# Altium project Industrial-Controller.PrjPcb (part 2 of 3)

## Sheet Industrial-Controller_Input.SchDoc: Isolated inputs
size 279 x 215 mm; Date: not used; ApprovedBy: not used; CheckedBy: not used; Author: not used; CompanyName: MRobot, LCC; DrawnBy: not used; Engineer: Podlesnyi Vasilii; Organization: not used; Address1: nab. reki Karpovki, d. 5/3E; Address2: Saint-Petersburg, 197022; Address3: Ph: +7 (911) 701-51-99; Address4: not used; DocumentNumber: 0000-0000; Revision: 0.1.0; SheetNumber: 5; SheetTotal: 21; ProjectTitle: Industrial Controller; Time: not used; ImagePath: not used; Application_BuildNumber: not used
Used 3 times, as channels Isolated inputs1, Isolated inputs2, Isolated inputs3. Parts and nets are listed once, with the designators drawn on the sheet.
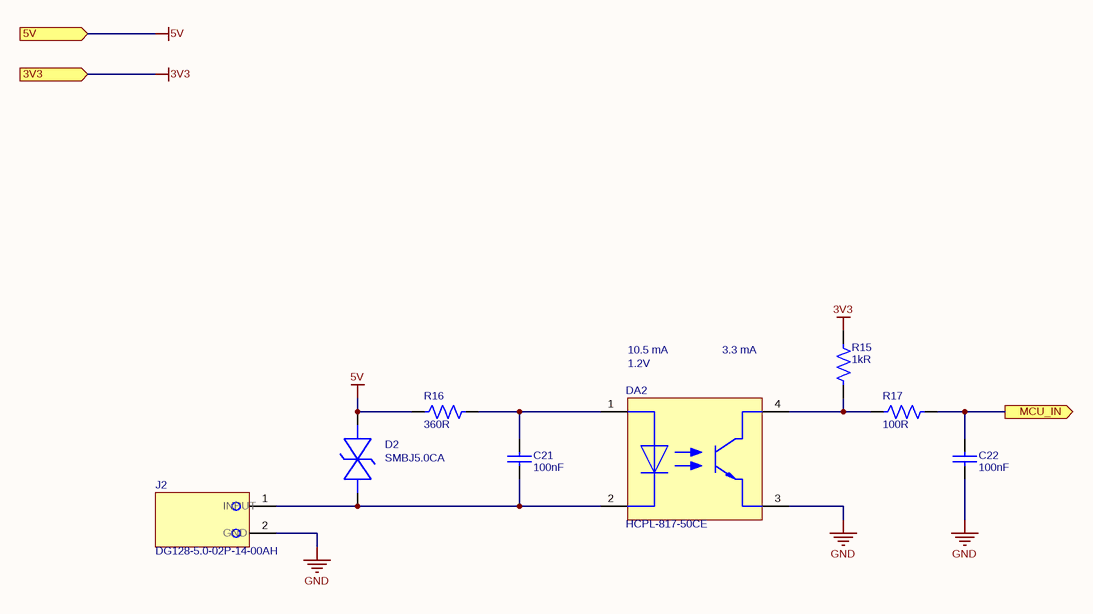
[diagram p5: Industrial-Controller_Input.SchDoc]

### Parts
C21  100nF  [CAP_0603]
C22  100nF  [CAP_0603]
D2  SMBJ5.0CA  [SMB-BIDIR]
DA2  HCPL-817-50CE  [HCPL-817-50CE]
J2  DG128-5.0-02P-14-00AH  [DG128-5.0-02P-14]
R15  1kR  [RES_0603]
R16  360R  [RES_0603]
R17  100R  [RES_0603]

### Ports
3V3 (in), 5V (in), MCU_IN (out)

### Nets
3V3: R15.1 ; port 3V3
5V: D2.1 R16.1 ; port 5V
GND: C22.2 DA2.3(EMITTER) J2.2
MCU_IN: C22.1 R17.1 ; port MCU_IN
NetC21_1: C21.1 DA2.1(ANODE) R16.2
NetC21_2: C21.2 D2.2 DA2.2(CATHODE) J2.1
NetDA2_4: DA2.4(COLLECTOR) R15.2 R17.2

### Channels
Isolated inputs1: designators end in A; ports 3V3=3V3 5V=5V MCU_IN=MCU_IN1
Isolated inputs2: designators end in B; ports 3V3=3V3 5V=5V MCU_IN=MCU_IN2
Isolated inputs3: designators end in C; ports 3V3=3V3 5V=5V MCU_IN=MCU_IN3

### Notes on the sheet
- (near DA2) 1.2V
- 10.5 mA
- 3.3 mA
- Title:
- Date:
- Size A
- Project:
- Number:
- Time:
- Sheet
- Revision
- of
- Engineer:
- www.mrobots.ru <http://mrobots.ru/>
- File:

### Library data of the parts
C21 C22 = CL10B104KB8NNNL: CAP CER 0.1UF 50V X7R 0603; Manufacturer 1: Samsung; Tolerance: 10%; Supplier 1: Digi-Key; Manufacturer Part Number 1: CL10B104KB8NNNL; RoHS: Yes; Category: Ceramic Capacitors; Stock 1: 2348404; Pricing 1: 15000=0,00532, 30000=0,00506 (USD); Mount: Surface Mount; Case/Package: 0603; Min Operating Temperature: -55°C; Max Operating Temperature: 125°C; Capacitance: 100nF; Packaging: Tape and Reel; Package Quantity: 15000; Voltage Rating: 50V; Dielectric: X7R; Voltage Rating (DC): 50V; Series: CL; Construction: Flat; Length: 1.6mm; Width: 0.031inch; Height: 0.8mm; Thickness: 0.035inch; Depth: 0.8mm; Radiation Hardening: No; RoHS Compliant: Yes; ComponentLink1URL: https://datasheet.ciiva.com/26838/getdatasheetpartid-357523-26838415.pdf?src-supplier=Verical; ComponentLink1Description: https://datasheet.ciiva.com/26838/getdatasheetpartid-357523-26838415.pdf?src-supplier=Verical; ComponentLink2URL: https://datasheet.ciiva.com/25741/cl10b104kb8nnnl-25741341.pdf?src-supplier=Digi-Key; ComponentLink2Description: https://datasheet.ciiva.com/25741/cl10b104kb8nnnl-25741341.pdf?src-supplier=Digi-Key; Supplier Part Number 1: 1276-CL10B104KB8NNNLTR-ND
D2 = SMBJ5.0CA: TVS DIODE 5VWM 9.2VC SMB; Manufacturer 1: Bourns; Direction: Bidirectional; Max Surge Current: 100A; Reverse Breakdown Voltage: 6.4V; Reverse Standoff Voltage: 5V; Clamping Voltage: 9.2V; Peak Pulse Power: 600W; Breakdown Voltage: 7.25V; Max Reverse Leakage Current: 1.6mA; Test Current: 10mA; Number of Elements: 1; Peak Pulse Current: 65.2A; Element Configuration: Single; Diode Type: ZENER; Operating Supply Voltage: 3.5V; Power Line Protection: No; Supplier 1: Arrow Electronics; RoHS: Yes; Category: TVS Diodes; Stock 1: 3000; Pricing 1: 3000=0,10850, 6000=0,10460, 15000=0,10360, 30000=0,10260 (USD); Mount: Surface Mount; Case/Package: DO-214AA; Number of Pins: 2; Min Operating Temperature: -55°C; Max Operating Temperature: 150°C; Packaging: Tape and Reel; Package Quantity: 1; Min Breakdown Voltage: 6.4V; Polarity: Bidirectional; Termination: SMD/SMT; Max Breakdown Voltage: 7.25V; Leakage Current: 1.6mA; Series: SMBJ; Number of Bidirectional Channels: 1; Number of Channels: 1; Max Power Dissipation: 600W; Resistor Type: Zener; Radiation Hardening: No; RoHS Compliant: Yes; REACH SVHC: No SVHC; ComponentLink1URL: https://datasheet.ciiva.com/334/smbj-334706.pdf?src-supplier=Digi-Key; ComponentLink1Description: https://datasheet.ciiva.com/334/smbj-334706.pdf?src-supplier=Digi-Key; ComponentLink2URL: https://datasheet.ciiva.com/3022/smbj-3022578.pdf?src-supplier=Avnet; ComponentLink2Description: https://datasheet.ciiva.com/3022/smbj-3022578.pdf?src-supplier=Avnet; ComponentLink3URL: https://datasheet.ciiva.com/334/smbj-334707.pdf?src-supplier=Digi-Key; ComponentLink3Description: https://datasheet.ciiva.com/334/smbj-334707.pdf?src-supplier=Digi-Key; ComponentLink4URL: https://datasheet.ciiva.com/334/smbj-334708.pdf?src-supplier=Digi-Key; ComponentLink4Description: https://datasheet.ciiva.com/334/smbj-334708.pdf?src-supplier=Digi-Key; ComponentLink5URL: https://datasheet.ciiva.com/28410/1677318-28410120.pdf?src-supplier=Element14; ComponentLink5Description: https://datasheet.ciiva.com/28410/1677318-28410120.pdf?src-supplier=Element14; ComponentLink6URL: https://datasheet.ciiva.com/8031/1677318-8031161.pdf?src-supplier=Element14; ComponentLink6Description: https://datasheet.ciiva.com/8031/1677318-8031161.pdf?src-supplier=Element14; ComponentLink7URL: https://datasheet.ciiva.com/30104/smbj-30104446.pdf?src-supplier=Onlinecomponents.com; ComponentLink7Description: https://datasheet.ciiva.com/30104/smbj-30104446.pdf?src-supplier=Onlinecomponents.com; Supplier Part Number 1: SMBJ5.0CA; Manufacturer Part Number 1: SMBJ5.0CA
DA2 = HCPL-817-50CE: OPTOISOLATOR 5KV TRANSISTOR 4SMD; Manufacturer 1: Broadcom Avago; Reverse Breakdown Voltage: 6V; Forward Voltage: 1.2V; Forward Current: 50mA; Rise Time: 18000ns; Max Power Dissipation: 200mW; Number of Channels: 1; Collector Emitter Voltage (VCEO): 35V; Collector Emitter Saturation Voltage: 200mV; Max Output Voltage: 70V; Current Transfer Ratio: 400%; Input Current: 20mA; Input Type: DC; Approvals: UL; Supplier 1: Mouser; RoHS: Yes; Category: Optocouplers; Stock 1: 53747; Pricing 1: 1=0,55000, 10=0,35900, 50=0,35900, 100=0,23700, 1000=0,18200, 10000=0,15000 (USD); Mount: Surface Mount; Case/Package: SMD/SMT; Number of Pins: 4; Min Operating Temperature: -30°C; Max Operating Temperature: 100°C; Package Quantity: 1000; Packaging: Tape and Reel; Max Collector Current: 50mA; Output Current per Channel: 50mA; Number of Elements: 1; Power Dissipation: 200mW; Fall Time: 18000ns; Max Input Current: 50mA; Collector Emitter Breakdown Voltage: 70V; Isolation Voltage: 5kV; Number of Circuits: 1; Output Voltage: 70V; Series: -; Collector-emitter Voltage-Max: 200mV; Lead Free: Lead Free; RoHS Compliant: Yes; ComponentLink1URL: https://datasheet.ciiva.com/32424/hcpl-817-00ae-eng-tds-32424469.pdf?src-supplier=Distrelec; ComponentLink1Description: https://datasheet.ciiva.com/32424/hcpl-817-00ae-eng-tds-32424469.pdf?src-supplier=Distrelec; ComponentLink2URL: https://datasheet.ciiva.com/4702/v02-0265en-106799-4702156.pdf?src-supplier=Mouser; ComponentLink2Description: https://datasheet.ciiva.com/4702/v02-0265en-106799-4702156.pdf?src-supplier=Mouser; Supplier Part Number 1: 630-HCPL-817-50CE; Manufacturer Part Number 1: HCPL-817-50CE
J2 = DG128-5.0-02P-14: TERM BLK 2P TOP ENTRY 5MM SMD; Manufacturer 1: Degson; Number of Contacts: 2; Stripping Length: 7mm; Contact_1: INPUT; Contact_2: GND; Category: Uncategorized; Color: Green; Contact Material: Brass,Tin; Height: 17.6mm; Length: 10.2mm; Mount: Screw; Pitch: 5mm; Weight: 2.4g; Width: 10mm; Manufacturer Part Number 1: DG128-5.0-02P-14-00AH
R15 = RC0603FR-071KL: RES 1K OHM 1% 1/10W 0603; Manufacturer 1: Yageo; Temperature Coefficient: 100ppm/°C; Power Rating: 100mW; Voltage Rating: 50V; Supplier 1: Arrow Electronics; Manufacturer Part Number 1: RC0603FR-071KL; RoHS: Yes; Category: Chip SMD Resistors; Stock 1: 480000; Pricing 1: 5000=0,00240, 10000=0,00230, 25000=0,00220, 125000=0,00190 (USD); Case/Package: 0603; Contact Plating: Tin,Matte; Case Code (Imperial): 0603; Case Code (Metric): 1608; Size Code: 0603; Min Operating Temperature: -55°C; Max Operating Temperature: 155°C; Tolerance: 1%; Resistance: 1kR; Packaging: Tape and Reel; Resistor Type: Thick Film; Termination: SMD/SMT; Features: Moisture Resistant; Series: RC; Max Power Dissipation: 100mW; Number of Terminations: 2; Technology: THICK FILM; Resistance Tolerance: 1%; Construction: Rectangular; Length: 1.6mm; Height: 0.45mm; Depth: 0.8mm; Radiation Hardening: No; REACH SVHC: No SVHC; Lead Free: Lead Free; Military Standard: Not; RoHS Compliant: Yes; Supplier Part Number 1: RC0603FR-071KL
R16 = RC0603FR-07360RL: RES 360 OHM 1% 1/10W 0603; Manufacturer 1: Yageo; Power Rating: 100mW; Voltage Rating: 50V; Temperature Coefficient: 100ppm/°C; Supplier 1: Arrow Electronics; RoHS: Yes; Category: Chip SMD Resistors; Stock 1: 7884; Pricing 1: 1=0,05320, 10=0,01120, 100=0,00760, 250=0,00660, 1000=0,00380, 3000=0,00370, 6000=0,00230 (USD); Case/Package: 0603; Case Code (Metric): 1608; Case Code (Imperial): 0603; Size Code: 0603; Min Operating Temperature: -55°C; Max Operating Temperature: 155°C; Packaging: Tape and Reel; Resistance: 360R; Tolerance: 1%; Package Quantity: 1; Resistor Type: Thick Film; Number of Terminations: 2; Termination: SMD/SMT; Max Power Dissipation: 100mW; Voltage Rating (DC): 50V; Features: Moisture Resistant; Series: RC; Construction: Rectangular; Length: 1.6mm; Width: 0.031inch; Height: 0.022inch; Depth: 0.8mm; Military Standard: Not; Lead Free: Lead Free; RoHS Compliant: Yes; ComponentLink1URL: https://datasheet.ciiva.com/2454/pyu-r-int-thick-7-2454271.pdf?src-supplier=Digi-Key; ComponentLink1Description: https://datasheet.ciiva.com/2454/pyu-r-int-thick-7-2454271.pdf?src-supplier=Digi-Key; ComponentLink2URL: https://datasheet.ciiva.com/2454/pyu-r-int-thick-7-2454272.pdf?src-supplier=Digi-Key; ComponentLink2Description: https://datasheet.ciiva.com/2454/pyu-r-int-thick-7-2454272.pdf?src-supplier=Digi-Key; ComponentLink3URL: https://datasheet.ciiva.com/2454/pyu-r-int-thick-7-2454270.pdf?src-supplier=Digi-Key; ComponentLink3Description: https://datasheet.ciiva.com/2454/pyu-r-int-thick-7-2454270.pdf?src-supplier=Digi-Key; ComponentLink4URL: https://datasheet.ciiva.com/12558/rc0603-272842-12558645.pdf?src-supplier=Mouser; ComponentLink4Description: https://datasheet.ciiva.com/12558/rc0603-272842-12558645.pdf?src-supplier=Mouser; Supplier Part Number 1: RC0603FR-07360RL; Manufacturer Part Number 1: RC0603FR-07360RL
R17 = RC0603FR-07100RL: RES 100 OHM 1% 1/10W 0603; Manufacturer 1: Yageo; Voltage Rating (DC): 50V; Temperature Coefficient: 100ppm/°C; Power Rating: 100mW; Supplier 1: Arrow Electronics; RoHS: Yes; Category: Chip SMD Resistors; Stock 1: 17580000; Pricing 1: 5000=0,00180 (USD); Case/Package: 0603; Number of Pins: 2; Case Code (Imperial): 0603; Case Code (Metric): 1608; Size Code: 0603; Min Operating Temperature: -55°C; Max Operating Temperature: 155°C; Resistance: 100R; Tolerance: 1%; Packaging: Tape and Reel; Resistor Type: Thick Film; Voltage Rating: 50V; Termination: SMD/SMT; Features: Moisture Resistant; Series: RC; Max Power Dissipation: 100mW; Number of Terminations: 2; Construction: Rectangular; Resistance Tolerance: 1%; Technology: THICK FILM; Length: 1.6mm; Width: 0.8mm; Height: 0.45mm; Depth: 0.8mm; REACH SVHC: Unknown; Lead Free: Lead Free; Military Standard: Not; RoHS Compliant: Yes; Supplier Part Number 1: RC0603FR-07100RL; Manufacturer Part Number 1: RC0603FR-07100RL

## Sheet Industrial-Controller_Relay.SchDoc: Relays
size 279 x 215 mm; Date: not used; ApprovedBy: not used; CheckedBy: not used; Author: not used; CompanyName: MRobot, LCC; DrawnBy: not used; Engineer: Podlesnyi Vasilii; Organization: not used; Address1: nab. reki Karpovki, d. 5/3E; Address2: Saint-Petersburg, 197022; Address3: Ph: +7 (911) 701-51-99; Address4: not used; DocumentNumber: 0000-0000; Revision: 0.1.0; SheetNumber: 6; SheetTotal: 21; ProjectTitle: Industrial Controller; Time: not used; ImagePath: not used; Application_BuildNumber: not used
Used 4 times, as channels Relays1, Relays2, Relays3, Relays4. Parts and nets are listed once, with the designators drawn on the sheet.
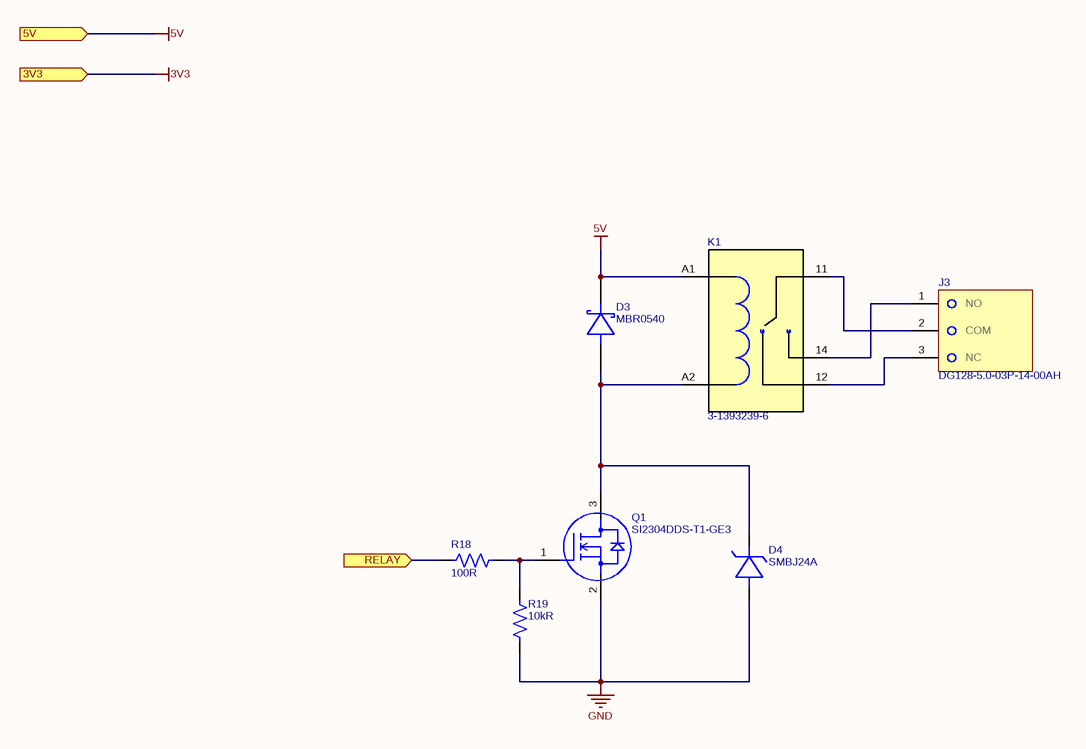
[diagram p6: Industrial-Controller_Relay.SchDoc]

### Parts
D3  MBR0540  [SOD-123]
D4  SMBJ24A  [SMB]
J3  DG128-5.0-03P-14-00AH  [DG128-5.0-03P-14]
K1  3-1393239-6  [3-1393239-6]
Q1  SI2304DDS-T1-GE3  [SOT-23-3]
R18  100R  [RES_0603]
R19  10kR  [RES_0603]

### Ports
3V3 (in), 5V (in), RELAY (in)

### Nets
3V3: port 3V3
5V: D3.1(C) K1.A1 ; port 5V
GND: D4.2(A) Q1.2(S) R19.2
RELAY: R18.1 ; port RELAY
NetD3_2: D3.2(A) D4.1(C) K1.A2 Q1.3(D)
NetJ3_1: J3.1 K1.14(NO)
NetJ3_2: J3.2 K1.11(COM)
NetJ3_3: J3.3 K1.12(NC)
NetQ1_1: Q1.1(G) R18.2 R19.1

### Channels
Relays1: designators end in A; ports 3V3=3V3 5V=5V RELAY=RELAY1
Relays2: designators end in B; ports 3V3=3V3 5V=5V RELAY=RELAY2
Relays3: designators end in C; ports 3V3=3V3 5V=5V RELAY=RELAY3
Relays4: designators end in D; ports 3V3=3V3 5V=5V RELAY=RELAY4

### Notes on the sheet
- Title:
- Date:
- Size A
- Project:
- Number:
- Time:
- Sheet
- Revision
- of
- Engineer:
- www.mrobots.ru <http://mrobots.ru/>
- File:

### Library data of the parts
D3 = MBR0540: DIODE SCHOTTKY 40V 500MA SOD123; Manufacturer: ON Semiconductor / Fairchild; Max Reverse Current: 20uA; Forward Voltage: 620mV; Peak Non-Repetitive Surge Current: 5.5A; Element Configuration: Single; Polarity: Standard; Current Rating: 500A; Power Dissipation: 400mW; Supplier 1: Arrow Electronics; Manufacturer Part Number: MBR0540; RoHS: Yes; Category: Schottky Diodes; Stock 1: 1; Pricing 1: 1=0,10130, 10=0,09370, 25=0,08240, 50=0,07560, 100=0,06800, 500=0,06720 (USD); Mount: Surface Mount; Number of Pins: 2; Contact Plating: Tin,Matte; Weight: 0.03g; Min Operating Temperature: -65°C; Max Operating Temperature: 125°C; Forward Current: 500mA; Package Quantity: 3000; Packaging: Tape and Reel; Average Rectified Current: 500mA; Max Repetitive Reverse Voltage (Vrrm): 40V; Max Forward Surge Current (Ifsm): 5.5A; Voltage Rating (DC): 40V; Output Current: 500mA; Max Reverse Voltage (DC): 40V; Max Surge Current: 5.5A; Max Reverse Leakage Current: 20uA; Length: 2.7mm; Width: 1.6mm; Height: 1.03mm; Radiation Hardening: No; Lead Free: Lead Free; RoHS Compliant: Yes; REACH SVHC: No SVHC; ComponentLink1URL: https://datasheet.ciiva.com/4713/mbr0540-90522-4713942.pdf?src-supplier=Mouser; ComponentLink1Description: https://datasheet.ciiva.com/4713/mbr0540-90522-4713942.pdf?src-supplier=Mouser; ComponentLink2URL: https://datasheet.ciiva.com/34301/975060-34301827.pdf?src-supplier=Jameco; ComponentLink2Description: https://datasheet.ciiva.com/34301/975060-34301827.pdf?src-supplier=Jameco; ComponentLink3URL: https://datasheet.ciiva.com/26943/getdatasheetpartid-110131-26943450.pdf?src-supplier=Verical; ComponentLink3Description: https://datasheet.ciiva.com/26943/getdatasheetpartid-110131-26943450.pdf?src-supplier=Verical; ComponentLink4URL: https://datasheet.ciiva.com/46428/1868854-46428603.pdf?src-supplier=Element14; ComponentLink4Description: https://datasheet.ciiva.com/46428/1868854-46428603.pdf?src-supplier=Element14; ComponentLink5URL: https://datasheet.ciiva.com/8303/mbr0540-8303805.pdf?src-supplier=Avnet; ComponentLink5Description: https://datasheet.ciiva.com/8303/mbr0540-8303805.pdf?src-supplier=Avnet; ComponentLink6URL: https://datasheet.ciiva.com/918/mbr0540-918355.pdf?src-supplier=Digi-Key; ComponentLink6Description: https://datasheet.ciiva.com/918/mbr0540-918355.pdf?src-supplier=Digi-Key; ComponentLink7URL: https://datasheet.ciiva.com/918/mbr0540-918356.pdf?src-supplier=Digi-Key; ComponentLink7Description: https://datasheet.ciiva.com/918/mbr0540-918356.pdf?src-supplier=Digi-Key; ComponentLink8URL: https://datasheet.ciiva.com/918/mbr0540-918354.pdf?src-supplier=Digi-Key; ComponentLink8Description: https://datasheet.ciiva.com/918/mbr0540-918354.pdf?src-supplier=Digi-Key; Supplier Part Number 1: MBR0540; Manufacturer 1: ON Semiconductor / Fairchild; Manufacturer Part Number 1: MBR0540
D4 = SMBJ24A: TVS DIODE 24VWM 38.9VC SMB; Manufacturer 1: Bourns; Direction: Unidirectional; Number of Elements: 1; Reverse Breakdown Voltage: 26.7V; Max Surge Current: 100A; Reverse Standoff Voltage: 24V; Clamping Voltage: 38.9V; Peak Pulse Power: 600W; Power Line Protection: No; Breakdown Voltage: 30.7V; Max Reverse Leakage Current: 5uA; Test Current: 1mA; Peak Pulse Current: 15.4A; Element Configuration: Single; Diode Type: ZENER; Operating Supply Voltage: 3.5V; ESD Protection: Yes; ComponentLink6URL: https://datasheet.ciiva.com/330/littelfuse-tvs-diode-smaj-datasheet-pdf-330796.pdf?src-supplier=Digi-Key; ComponentLink6Description: https://datasheet.ciiva.com/330/littelfuse-tvs-diode-smaj-datasheet-pdf-330796.pdf?src-supplier=Digi-Key; Supplier 1: Arrow Electronics; RoHS: Yes; Category: TVS Diodes; Stock 1: 14; Pricing 1: 1=0,52680, 10=0,35320 (USD); Mount: Surface Mount; Case/Package: SMB; Number of Pins: 2; Min Operating Temperature: -55°C; Max Operating Temperature: 150°C; Packaging: Tape and Reel; Package Quantity: 1; Number of Unidirectional Channels: 1; Min Breakdown Voltage: 26.7V; Polarity: Unidirectional; Termination: SMD/SMT; Max Breakdown Voltage: 30.7V; Max Power Dissipation: 600W; Leakage Current: 5uA; Resistor Type: Zener; Series: SMBJ; Number of Channels: 1; Length: 4.57mm; Width: 3.94mm; Height: 2.42mm; Radiation Hardening: No; RoHS Compliant: Yes; REACH SVHC: No SVHC; ComponentLink1URL: https://datasheet.ciiva.com/30478/0900766b81189a19-30478832.pdf?src-supplier=RSComponents; ComponentLink1Description: https://datasheet.ciiva.com/30478/0900766b81189a19-30478832.pdf?src-supplier=RSComponents; ComponentLink2URL: https://datasheet.ciiva.com/3022/smbj-3022496.pdf?src-supplier=Avnet; ComponentLink2Description: https://datasheet.ciiva.com/3022/smbj-3022496.pdf?src-supplier=Avnet; ComponentLink3URL: https://datasheet.ciiva.com/3022/smbj-3022497.pdf?src-supplier=Avnet; ComponentLink3Description: https://datasheet.ciiva.com/3022/smbj-3022497.pdf?src-supplier=Avnet; ComponentLink4URL: https://datasheet.ciiva.com/342/smbj-342022.pdf?src-supplier=Digi-Key; ComponentLink4Description: https://datasheet.ciiva.com/342/smbj-342022.pdf?src-supplier=Digi-Key; ComponentLink5URL: https://datasheet.ciiva.com/8031/1677318-8031064.pdf?src-supplier=Element14; ComponentLink5Description: https://datasheet.ciiva.com/8031/1677318-8031064.pdf?src-supplier=Element14; ComponentLink7URL: https://datasheet.ciiva.com/28410/1677318-28410012.pdf?src-supplier=Element14; ComponentLink7Description: https://datasheet.ciiva.com/28410/1677318-28410012.pdf?src-supplier=Element14; ComponentLink8URL: https://datasheet.ciiva.com/342/smbj-342020.pdf?src-supplier=Digi-Key; ComponentLink8Description: https://datasheet.ciiva.com/342/smbj-342020.pdf?src-supplier=Digi-Key; ComponentLink9URL: https://datasheet.ciiva.com/342/smbj-342021.pdf?src-supplier=Digi-Key; ComponentLink9Description: https://datasheet.ciiva.com/342/smbj-342021.pdf?src-supplier=Digi-Key; ComponentLink10URL: https://datasheet.ciiva.com/16237/smbj-16237468.pdf?src-supplier=Onlinecomponents.com; ComponentLink10Description: https://datasheet.ciiva.com/16237/smbj-16237468.pdf?src-supplier=Onlinecomponents.com; ComponentLink11URL: https://datasheet.ciiva.com/48712/001056314-da-01-en-tvs-diode-smbj24a-do-214aa-bou-48712566.pdf?src-supplier=Conrad; ComponentLink11Description: https://datasheet.ciiva.com/48712/001056314-da-01-en-tvs-diode-smbj24a-do-214aa-bou-48712566.pdf?src-supplier=Conrad; Supplier Part Number 1: SMBJ24A; Manufacturer Part Number 1: SMBJ24A
J3 = DG128-5.0-03P-14: TERM BLK 3P TOP ENTRY 5MM SMD; Manufacturer 1: Degson; Number of Contacts: 3; Stripping Length: 7mm; Contact_1: NO; Contact_2: COM; Contact_3: NC; Category: Uncategorized; Color: Green; Contact Material: Brass,Tin; Height: 17.6mm; Length: 10.2mm; Mount: Screw; Pitch: 5mm; Weight: 4g; Width: 15mm; Manufacturer Part Number 1: DG128-5.0-03P-14-00AH
K1 = 3-1393239-6: RELAY GEN PURPOSE SPDT 10A 5V; Manufacturer 1: TE Connectivity Schrack; Supplier 1: Arrow Electronics; RoHS: Yes; Category: Signal Relays; Stock 1: 3333; Pricing 1: 1=1,30120 (USD); ComponentLink1URL: https://datasheet.ciiva.com/2409/eng-ds-rt1-sensitive-0910-2409155.pdf?src-supplier=Avnet; ComponentLink1Description: https://datasheet.ciiva.com/2409/eng-ds-rt1-sensitive-0910-2409155.pdf?src-supplier=Avnet; ComponentLink2URL: https://datasheet.ciiva.com/14146/rt1sens-eng-datasheet-14146563.pdf?src-supplier=Distrelec; ComponentLink2Description: https://datasheet.ciiva.com/14146/rt1sens-eng-datasheet-14146563.pdf?src-supplier=Distrelec; ComponentLink3URL: https://datasheet.ciiva.com/16307/3-1393239-6-16307647.pdf?src-supplier=Future+Electronics; ComponentLink3Description: https://datasheet.ciiva.com/16307/3-1393239-6-16307647.pdf?src-supplier=Future+Electronics; ComponentLink4URL: https://datasheet.ciiva.com/14190/eng-ds-rt1-sensitive-0411-14190113.pdf?src-supplier=Avnet; ComponentLink4Description: https://datasheet.ciiva.com/14190/eng-ds-rt1-sensitive-0411-14190113.pdf?src-supplier=Avnet; ComponentLink5URL: https://datasheet.ciiva.com/30127/eng-ds-rt1-sensitive-0411-30127511.pdf?src-supplier=Onlinecomponents.com; ComponentLink5Description: https://datasheet.ciiva.com/30127/eng-ds-rt1-sensitive-0411-30127511.pdf?src-supplier=Onlinecomponents.com; Supplier Part Number 1: RT174005; Manufacturer Part Number 1: 3-1393239-6
Q1 = SI2304DDS-T1-GE3: MOSFET N-CH 30V 3.3A/3.6A SOT23; Manufacturer 1: Vishay Siliconix; Nominal Vgs: 2.2V; Rds On Max: 850mR; Input Capacitance: 35pF; Rise Time: 50ns; Continuous Drain Current (ID): 3.6A; Max Power Dissipation: 200mW; Drain to Source Resistance: 49mR; Number of Elements: 1; Power Dissipation: 1.1W; Turn-Off Delay Time: 12ns; Fall Time: 22ns; Element Configuration: Single; Gate to Source Voltage (Vgs): 20V; On-State Resistance: 60mR; Polarity: N-CHANNEL; Supplier 1: Digi-Key; Manufacturer Part Number 1: SI2304DDS-T1-GE3; RoHS: Yes; Category: MOSFETs; Stock 1: 5879; Pricing 1: 1=0,45000, 10=0,36200, 100=0,24640, 500=0,18480, 1000=0,13860 (USD); Mount: Surface Mount; Case/Package: SOT-23-3; Number of Pins: 3; Weight: 0.050717oz; Contact Plating: Tin,Matte; Min Operating Temperature: -55°C; Max Operating Temperature: 150°C; Packaging: Tape and Reel; Package Quantity: 3000; Drain to Source Voltage (Vdss): 30V; Drain to Source Breakdown Voltage: 30V; Threshold Voltage: 2.2V; Turn-On Delay Time: 12ns; Number of Channels: 1; Series: TrenchFET®; Drain-source On Resistance-Max: 60mR; Radiation Hardening: No; REACH SVHC: No SVHC; Lead Free: Lead Free; RoHS Compliant: Yes; ComponentLink1URL: https://datasheet.ciiva.com/5769/si2304dd-5769090.pdf?src-supplier=Farnell; ComponentLink1Description: https://datasheet.ciiva.com/5769/si2304dd-5769090.pdf?src-supplier=Farnell; ComponentLink2URL: https://datasheet.ciiva.com/7370/1750671-7370955.pdf?src-supplier=Newark; ComponentLink2Description: https://datasheet.ciiva.com/7370/1750671-7370955.pdf?src-supplier=Newark; ComponentLink3URL: https://datasheet.ciiva.com/4441/si2304dd-244438-4441695.pdf?src-supplier=Mouser; ComponentLink3Description: https://datasheet.ciiva.com/4441/si2304dd-244438-4441695.pdf?src-supplier=Mouser; ComponentLink4URL: https://datasheet.ciiva.com/2957/si2304dd-2957371.pdf?src-supplier=Digi-Key; ComponentLink4Description: https://datasheet.ciiva.com/2957/si2304dd-2957371.pdf?src-supplier=Digi-Key; ComponentLink5URL: https://datasheet.ciiva.com/7788/si2304dd-7788750.pdf?src-supplier=Element14; ComponentLink5Description: https://datasheet.ciiva.com/7788/si2304dd-7788750.pdf?src-supplier=Element14; ComponentLink6URL: https://datasheet.ciiva.com/8115/si2304dd-8115070.pdf?src-supplier=Avnet; ComponentLink6Description: https://datasheet.ciiva.com/8115/si2304dd-8115070.pdf?src-supplier=Avnet; ComponentLink7URL: https://datasheet.ciiva.com/2957/si2304dd-2957372.pdf?src-supplier=Digi-Key; ComponentLink7Description: https://datasheet.ciiva.com/2957/si2304dd-2957372.pdf?src-supplier=Digi-Key; ComponentLink8URL: https://datasheet.ciiva.com/26137/si2304dd-26137837.pdf?src-supplier=Avnet+Europe; ComponentLink8Description: https://datasheet.ciiva.com/26137/si2304dd-26137837.pdf?src-supplier=Avnet+Europe; Supplier Part Number 1: SI2304DDS-T1-GE3CT-ND
R18 = RC0603FR-07100RL: as R17 on sheet Industrial-Controller_Input; Supplier 1: Arrow Electronics; RoHS: Yes; Category: Chip SMD Resistors; Stock 1: 17580000; Pricing 1: 5000=0,00180 (USD); Case/Package: 0603; Number of Pins: 2; Case Code (Imperial): 0603; Case Code (Metric): 1608; Size Code: 0603; Min Operating Temperature: -55°C; Max Operating Temperature: 155°C; Resistance: 100R; Tolerance: 1%; Packaging: Tape and Reel; Resistor Type: Thick Film; Voltage Rating: 50V; Termination: SMD/SMT; Features: Moisture Resistant; Series: RC; Max Power Dissipation: 100mW; Number of Terminations: 2; Construction: Rectangular; Resistance Tolerance: 1%; Technology: THICK FILM; Length: 1.6mm; Width: 0.8mm; Height: 0.45mm; Depth: 0.8mm; REACH SVHC: Unknown; Lead Free: Lead Free; Military Standard: Not; RoHS Compliant: Yes; Supplier Part Number 1: RC0603FR-07100RL; Manufacturer Part Number 1: RC0603FR-07100RL
R19 = RC0603FR-0710KL: RES 10K OHM 1% 1/10W 0603; Manufacturer 1: Yageo; Voltage Rating (DC): 50V; Temperature Coefficient: 100ppm/°C; Power Rating: 100mW; Voltage Rating: 75V; Supplier 1: Arrow Electronics; RoHS: Yes; Category: Chip SMD Resistors; Stock 1: 4950000; Pricing 1: 5000=0,00240 (USD); Case/Package: 0603; Number of Pins: 2; Case Code (Imperial): 0603; Case Code (Metric): 1608; Weight: 7.1E-05oz; Size Code: 0603; Min Operating Temperature: -55°C; Max Operating Temperature: 155°C; Packaging: Tape and Reel; Resistance: 10kR; Tolerance: 1%; Resistor Type: Thick Film; Termination: SMD/SMT; Features: Moisture Resistant; Series: RC; Max Power Dissipation: 100mW; Number of Terminations: 2; Resistance Tolerance: 1%; Construction: Rectangular; Length: 1.6mm; Width: 0.8mm; Height: 0.45mm; Depth: 0.8mm; Lead Pitch: 0.3mm; REACH SVHC: Unknown; Lead Free: Lead Free; Military Standard: Not; RoHS Compliant: Yes; ComponentLink1URL: https://datasheet.ciiva.com/7660/38590-7660789.pdf?src-supplier=Element14; ComponentLink1Description: https://datasheet.ciiva.com/7660/38590-7660789.pdf?src-supplier=Element14; ComponentLink2URL: https://datasheet.ciiva.com/7983/443971-7983596.pdf?src-supplier=Element14; ComponentLink2Description: https://datasheet.ciiva.com/7983/443971-7983596.pdf?src-supplier=Element14; ComponentLink3URL: https://datasheet.ciiva.com/22747/443971-22747519.pdf?src-supplier=Element14; ComponentLink3Description: https://datasheet.ciiva.com/22747/443971-22747519.pdf?src-supplier=Element14; ComponentLink4URL: https://datasheet.ciiva.com/46440/1868787-46440891.pdf?src-supplier=Element14; ComponentLink4Description: https://datasheet.ciiva.com/46440/1868787-46440891.pdf?src-supplier=Element14; ComponentLink5URL: https://datasheet.ciiva.com/7746/1738695-7746239.pdf?src-supplier=Element14; ComponentLink5Description: https://datasheet.ciiva.com/7746/1738695-7746239.pdf?src-supplier=Element14; Supplier Part Number 1: RC0603FR-0710KL; Manufacturer Part Number 1: RC0603FR-0710KL

## Sheet Industrial-Controller_Fan.SchDoc: Fan
size 279 x 215 mm; Date: not used; ApprovedBy: not used; CheckedBy: not used; Author: not used; CompanyName: MRobot, LCC; DrawnBy: not used; Engineer: Podlesnyi Vasilii; Organization: not used; Address1: nab. reki Karpovki, d. 5/3E; Address2: Saint-Petersburg, 197022; Address3: Ph: +7 (911) 701-51-99; Address4: not used; DocumentNumber: 0000-0000; Revision: 0.1.0; SheetNumber: 9; SheetTotal: 21; ProjectTitle: Industrial Controller; Time: not used; ImagePath: not used; Application_BuildNumber: not used
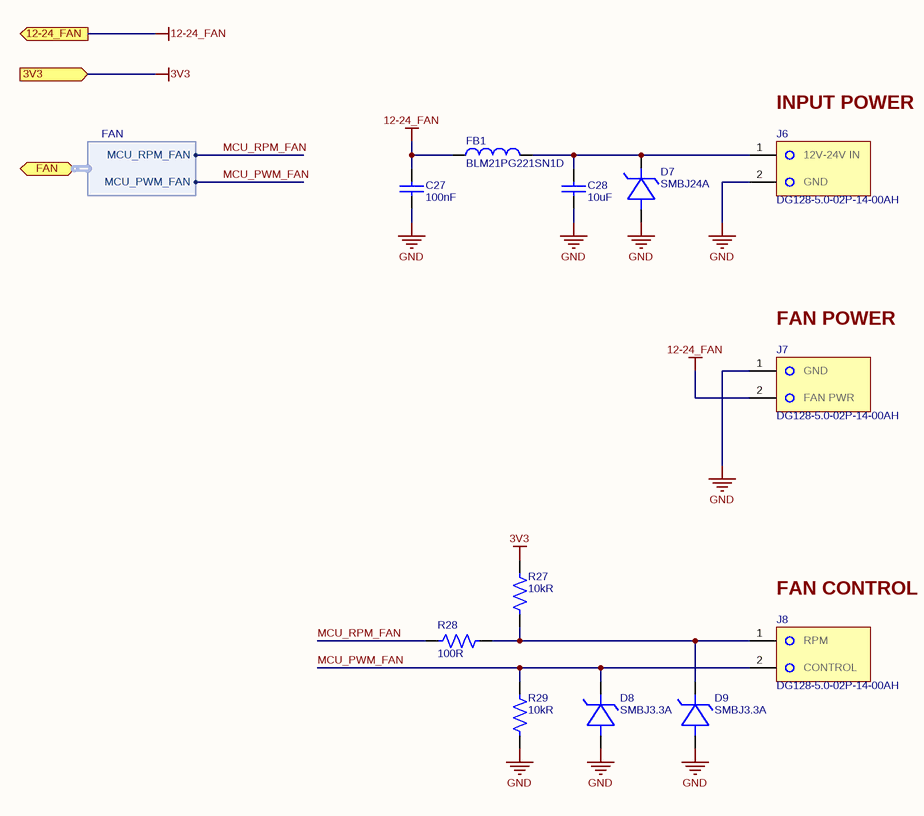
[diagram p7: Industrial-Controller_Fan.SchDoc]

### Parts
C27  100nF  [CAP_0603]
C28  10uF  [CAP_1210]
D7  SMBJ24A  [SMB]
D8  SMBJ3.3A  [SMB]
D9  SMBJ3.3A  [SMB]
FB1  BLM21PG221SN1D  [L0805]
J6  DG128-5.0-02P-14-00AH  [DG128-5.0-02P-14]
J7  DG128-5.0-02P-14-00AH  [DG128-5.0-02P-14]
J8  DG128-5.0-02P-14-00AH  [DG128-5.0-02P-14]
R27  10kR  [RES_0603]
R28  100R  [RES_0603]
R29  10kR  [RES_0603]

### Ports
3V3 (in), 12-24_FAN (out), FAN (bidir, harness FAN)

### Harnesses
FAN: MCU_RPM_FAN, MCU_PWM_FAN

### Nets
3V3: R27.1 ; port 3V3
12-24_FAN: C27.1 FB1.1 J7.2 ; port 12-24_FAN
GND: C27.2 C28.1 D7.2(A) D8.2(A) D9.2(A) J6.2 J7.1 R29.2
MCU_PWM_FAN: D8.1(C) J8.2 R29.1 ; port FAN.MCU_PWM_FAN
MCU_RPM_FAN: R28.2 ; port FAN.MCU_RPM_FAN
NetC28_2: C28.2 D7.1(C) FB1.2 J6.1
NetD9_1: D9.1(C) J8.1 R27.2 R28.1

### Notes on the sheet
- (near J6) INPUT POWER
- (near J7) FAN POWER
- (near J8) FAN CONTROL
- Title:
- Date:
- Size A
- Project:
- Number:
- Time:
- Sheet
- Revision
- of
- Engineer:
- www.mrobots.ru <http://mrobots.ru/>
- File:

### Library data of the parts
C27 = CL10B104KB8NNNL: as C21 on sheet Industrial-Controller_Input; Supplier 1: Digi-Key; Manufacturer Part Number 1: CL10B104KB8NNNL; RoHS: Yes; Category: Ceramic Capacitors; Stock 1: 2348404; Pricing 1: 15000=0,00532, 30000=0,00506 (USD); Mount: Surface Mount; Case/Package: 0603; Min Operating Temperature: -55°C; Max Operating Temperature: 125°C; Capacitance: 100nF; Packaging: Tape and Reel; Package Quantity: 15000; Voltage Rating: 50V; Dielectric: X7R; Voltage Rating (DC): 50V; Series: CL; Construction: Flat; Length: 1.6mm; Width: 0.031inch; Height: 0.8mm; Thickness: 0.035inch; Depth: 0.8mm; Radiation Hardening: No; RoHS Compliant: Yes; ComponentLink1URL: https://datasheet.ciiva.com/26838/getdatasheetpartid-357523-26838415.pdf?src-supplier=Verical; ComponentLink1Description: https://datasheet.ciiva.com/26838/getdatasheetpartid-357523-26838415.pdf?src-supplier=Verical; ComponentLink2URL: https://datasheet.ciiva.com/25741/cl10b104kb8nnnl-25741341.pdf?src-supplier=Digi-Key; ComponentLink2Description: https://datasheet.ciiva.com/25741/cl10b104kb8nnnl-25741341.pdf?src-supplier=Digi-Key; Supplier Part Number 1: 1276-CL10B104KB8NNNLTR-ND
C28 = CL32B106KBJNNWE: CAP CER 10UF 50V X7R 1210; Manufacturer 1: Samsung; Tolerance: 10%; Supplier 1: Digi-Key; Manufacturer Part Number 1: CL32B106KBJNNWE; RoHS: Yes; Category: Ceramic Capacitors; Stock 1: 395336; Pricing 1: 1=0,64000, 10=0,45500, 50=0,34380, 100=0,29940, 500=0,22176 (USD); Mount: Surface Mount; Case/Package: 1210; Case Code (Imperial): 1210; Case Code (Metric): 3225; Min Operating Temperature: -55°C; Max Operating Temperature: 125°C; Dielectric: X7R; Capacitance: 10uF; Voltage Rating: 50V; Package Quantity: 1; Packaging: Tape and Reel; Length: 0.126inch; Width: 0.098inch; Thickness: 0.106inch; Lead Free: Lead Free; ComponentLink1URL: https://datasheet.ciiva.com/25721/cl32b106kbjnnwe-25721651.pdf?src-supplier=Digi-Key; ComponentLink1Description: https://datasheet.ciiva.com/25721/cl32b106kbjnnwe-25721651.pdf?src-supplier=Digi-Key; Supplier Part Number 1: 1276-3388-1-ND
D7 = SMBJ24A: as D4 on sheet Industrial-Controller_Relay; ComponentLink6URL: https://datasheet.ciiva.com/330/littelfuse-tvs-diode-smaj-datasheet-pdf-330796.pdf?src-supplier=Digi-Key; ComponentLink6Description: https://datasheet.ciiva.com/330/littelfuse-tvs-diode-smaj-datasheet-pdf-330796.pdf?src-supplier=Digi-Key; Supplier 1: Arrow Electronics; RoHS: Yes; Category: TVS Diodes; Stock 1: 14; Pricing 1: 1=0,52680, 10=0,35320 (USD); Mount: Surface Mount; Case/Package: SMB; Number of Pins: 2; Min Operating Temperature: -55°C; Max Operating Temperature: 150°C; Packaging: Tape and Reel; Package Quantity: 1; Number of Unidirectional Channels: 1; Min Breakdown Voltage: 26.7V; Polarity: Unidirectional; Termination: SMD/SMT; Max Breakdown Voltage: 30.7V; Max Power Dissipation: 600W; Leakage Current: 5uA; Resistor Type: Zener; Series: SMBJ; Number of Channels: 1; Length: 4.57mm; Width: 3.94mm; Height: 2.42mm; Radiation Hardening: No; RoHS Compliant: Yes; REACH SVHC: No SVHC; ComponentLink1URL: https://datasheet.ciiva.com/30478/0900766b81189a19-30478832.pdf?src-supplier=RSComponents; ComponentLink1Description: https://datasheet.ciiva.com/30478/0900766b81189a19-30478832.pdf?src-supplier=RSComponents; ComponentLink2URL: https://datasheet.ciiva.com/3022/smbj-3022496.pdf?src-supplier=Avnet; ComponentLink2Description: https://datasheet.ciiva.com/3022/smbj-3022496.pdf?src-supplier=Avnet; ComponentLink3URL: https://datasheet.ciiva.com/3022/smbj-3022497.pdf?src-supplier=Avnet; ComponentLink3Description: https://datasheet.ciiva.com/3022/smbj-3022497.pdf?src-supplier=Avnet; ComponentLink4URL: https://datasheet.ciiva.com/342/smbj-342022.pdf?src-supplier=Digi-Key; ComponentLink4Description: https://datasheet.ciiva.com/342/smbj-342022.pdf?src-supplier=Digi-Key; ComponentLink5URL: https://datasheet.ciiva.com/8031/1677318-8031064.pdf?src-supplier=Element14; ComponentLink5Description: https://datasheet.ciiva.com/8031/1677318-8031064.pdf?src-supplier=Element14; ComponentLink7URL: https://datasheet.ciiva.com/28410/1677318-28410012.pdf?src-supplier=Element14; ComponentLink7Description: https://datasheet.ciiva.com/28410/1677318-28410012.pdf?src-supplier=Element14; ComponentLink8URL: https://datasheet.ciiva.com/342/smbj-342020.pdf?src-supplier=Digi-Key; ComponentLink8Description: https://datasheet.ciiva.com/342/smbj-342020.pdf?src-supplier=Digi-Key; ComponentLink9URL: https://datasheet.ciiva.com/342/smbj-342021.pdf?src-supplier=Digi-Key; ComponentLink9Description: https://datasheet.ciiva.com/342/smbj-342021.pdf?src-supplier=Digi-Key; ComponentLink10URL: https://datasheet.ciiva.com/16237/smbj-16237468.pdf?src-supplier=Onlinecomponents.com; ComponentLink10Description: https://datasheet.ciiva.com/16237/smbj-16237468.pdf?src-supplier=Onlinecomponents.com; ComponentLink11URL: https://datasheet.ciiva.com/48712/001056314-da-01-en-tvs-diode-smbj24a-do-214aa-bou-48712566.pdf?src-supplier=Conrad; ComponentLink11Description: https://datasheet.ciiva.com/48712/001056314-da-01-en-tvs-diode-smbj24a-do-214aa-bou-48712566.pdf?src-supplier=Conrad; Supplier Part Number 1: SMBJ24A; Manufacturer Part Number 1: SMBJ24A
D8 D9 = SMBJ3.3A: TVS DIODE 3.3VWM 4.1VC SMB; Manufacturer 1: JGD Semiconductors Co.,Ltd; Manufacturer Part Number 1: SMBJ3.3A
FB1 = BLM21PG221SN1D: FERRITE BEAD 220 OHM 0805 1LN; Manufacturer 1: Murata; Material: Ferrite,Steel; Impedance: 220R; Tolerance: 25%; Max Current Rating: 2A; Number of Lines: 1; DC Resistance (DCR): 45mR; Test Frequency: 100MHz; Shielding: Unshielded; Supplier 1: Arrow Electronics; RoHS: Yes; Category: Ferrite Beads and Chips; Stock 1: 7; Pricing 1: 1=0,09630 (USD); Case/Package: 0805; Number of Pins: 2; Core Material: Ferrite; Case Code (Metric): 2012; Case Code (Imperial): 0805; Contact Plating: Tin,Matte; Min Operating Temperature: -55°C; Max Operating Temperature: 125°C; Package Quantity: 1; Packaging: Tape and Reel; Current Rating: 2A; Max DC Current: 2A; Termination: SMD/SMT; DC Current: 2A; Frequency: 100MHz; Number of Circuits: 1; Current: 2A; Series: BLM21P; DC Resistance-Max: 45mR; Length: 2mm; Width: 1.25mm; Height: 0.85mm; Depth: 1.25mm; Radiation Hardening: No; REACH SVHC: No SVHC; Military Standard: Not; Lead Free: Lead Free; RoHS Compliant: Yes; ComponentLink1URL: https://datasheet.ciiva.com/30514/1845321-30514028.pdf?src-supplier=Jameco; ComponentLink1Description: https://datasheet.ciiva.com/30514/1845321-30514028.pdf?src-supplier=Jameco; ComponentLink2URL: https://datasheet.ciiva.com/1012/l0110s0100blm21p-1012288.pdf?src-supplier=Digi-Key; ComponentLink2Description: https://datasheet.ciiva.com/1012/l0110s0100blm21p-1012288.pdf?src-supplier=Digi-Key; ComponentLink3URL: https://datasheet.ciiva.com/11799/0900766b81275e31-11799232.pdf?src-supplier=RSComponents; ComponentLink3Description: https://datasheet.ciiva.com/11799/0900766b81275e31-11799232.pdf?src-supplier=RSComponents; ComponentLink4URL: https://datasheet.ciiva.com/29348/442529-da-01-en-chip-drossel-0805-220r-2000ma-2-0x1-25mm-29348007.pdf?src-supplier=Conrad; ComponentLink4Description: https://datasheet.ciiva.com/29348/442529-da-01-en-chip-drossel-0805-220r-2000ma-2-0x1-25mm-29348007.pdf?src-supplier=Conrad; ComponentLink5URL: https://datasheet.ciiva.com/8021/1756152-8021596.pdf?src-supplier=Element14; ComponentLink5Description: https://datasheet.ciiva.com/8021/1756152-8021596.pdf?src-supplier=Element14; ComponentLink6URL: https://datasheet.ciiva.com/8021/1756152-8021598.pdf?src-supplier=Element14; ComponentLink6Description: https://datasheet.ciiva.com/8021/1756152-8021598.pdf?src-supplier=Element14; ComponentLink7URL: https://datasheet.ciiva.com/14122/anblm21p-data-e-14122214.pdf?src-supplier=Distrelec; ComponentLink7Description: https://datasheet.ciiva.com/14122/anblm21p-data-e-14122214.pdf?src-supplier=Distrelec; ComponentLink8URL: https://datasheet.ciiva.com/1012/l0110s0100blm21p-1012287.pdf?src-supplier=Digi-Key; ComponentLink8Description: https://datasheet.ciiva.com/1012/l0110s0100blm21p-1012287.pdf?src-supplier=Digi-Key; ComponentLink9URL: https://datasheet.ciiva.com/1012/l0110s0100blm21p-1012289.pdf?src-supplier=Digi-Key; ComponentLink9Description: https://datasheet.ciiva.com/1012/l0110s0100blm21p-1012289.pdf?src-supplier=Digi-Key; ComponentLink10URL: https://datasheet.ciiva.com/3081/l0110s0100blm21p-3081655.pdf?src-supplier=Avnet; ComponentLink10Description: https://datasheet.ciiva.com/3081/l0110s0100blm21p-3081655.pdf?src-supplier=Avnet; ComponentLink11URL: https://datasheet.ciiva.com/16215/l0110s0100blm21p-16215194.pdf?src-supplier=Future+Electronics; ComponentLink11Description: https://datasheet.ciiva.com/16215/l0110s0100blm21p-16215194.pdf?src-supplier=Future+Electronics; Supplier Part Number 1: BLM21PG221SN1D; Manufacturer Part Number 1: BLM21PG221SN1D
J6 = DG128-5.0-02P-14: TERM BLK 2P TOP ENTRY 5MM SMD; Manufacturer 1: Degson; Number of Contacts: 2; Stripping Length: 7mm; Contact_1: 12V-24V IN; Contact_2: GND; Category: Uncategorized; Color: Green; Contact Material: Brass,Tin; Height: 17.6mm; Length: 10.2mm; Mount: Screw; Pitch: 5mm; Weight: 2.4g; Width: 10mm; Manufacturer Part Number 1: DG128-5.0-02P-14-00AH
J7 = DG128-5.0-02P-14: TERM BLK 2P TOP ENTRY 5MM SMD; Manufacturer 1: Degson; Number of Contacts: 2; Stripping Length: 7mm; Contact_1: GND; Contact_2: FAN PWR; Category: Uncategorized; Color: Green; Contact Material: Brass,Tin; Height: 17.6mm; Length: 10.2mm; Mount: Screw; Pitch: 5mm; Weight: 2.4g; Width: 10mm; Manufacturer Part Number 1: DG128-5.0-02P-14-00AH
J8 = DG128-5.0-02P-14: TERM BLK 2P TOP ENTRY 5MM SMD; Manufacturer 1: Degson; Number of Contacts: 2; Stripping Length: 7mm; Contact_1: RPM; Contact_2: CONTROL; Category: Uncategorized; Color: Green; Contact Material: Brass,Tin; Height: 17.6mm; Length: 10.2mm; Mount: Screw; Pitch: 5mm; Weight: 2.4g; Width: 10mm; Manufacturer Part Number 1: DG128-5.0-02P-14-00AH
R27 R29 = RC0603FR-0710KL: as R19 on sheet Industrial-Controller_Relay; Supplier 1: Arrow Electronics; RoHS: Yes; Category: Chip SMD Resistors; Stock 1: 4950000; Pricing 1: 5000=0,00240 (USD); Case/Package: 0603; Number of Pins: 2; Case Code (Imperial): 0603; Case Code (Metric): 1608; Weight: 7.1E-05oz; Size Code: 0603; Min Operating Temperature: -55°C; Max Operating Temperature: 155°C; Packaging: Tape and Reel; Resistance: 10kR; Tolerance: 1%; Resistor Type: Thick Film; Termination: SMD/SMT; Features: Moisture Resistant; Series: RC; Max Power Dissipation: 100mW; Number of Terminations: 2; Resistance Tolerance: 1%; Construction: Rectangular; Length: 1.6mm; Width: 0.8mm; Height: 0.45mm; Depth: 0.8mm; Lead Pitch: 0.3mm; REACH SVHC: Unknown; Lead Free: Lead Free; Military Standard: Not; RoHS Compliant: Yes; ComponentLink1URL: https://datasheet.ciiva.com/7660/38590-7660789.pdf?src-supplier=Element14; ComponentLink1Description: https://datasheet.ciiva.com/7660/38590-7660789.pdf?src-supplier=Element14; ComponentLink2URL: https://datasheet.ciiva.com/7983/443971-7983596.pdf?src-supplier=Element14; ComponentLink2Description: https://datasheet.ciiva.com/7983/443971-7983596.pdf?src-supplier=Element14; ComponentLink3URL: https://datasheet.ciiva.com/22747/443971-22747519.pdf?src-supplier=Element14; ComponentLink3Description: https://datasheet.ciiva.com/22747/443971-22747519.pdf?src-supplier=Element14; ComponentLink4URL: https://datasheet.ciiva.com/46440/1868787-46440891.pdf?src-supplier=Element14; ComponentLink4Description: https://datasheet.ciiva.com/46440/1868787-46440891.pdf?src-supplier=Element14; ComponentLink5URL: https://datasheet.ciiva.com/7746/1738695-7746239.pdf?src-supplier=Element14; ComponentLink5Description: https://datasheet.ciiva.com/7746/1738695-7746239.pdf?src-supplier=Element14; Supplier Part Number 1: RC0603FR-0710KL; Manufacturer Part Number 1: RC0603FR-0710KL
R28 = RC0603FR-07100RL: as R17 on sheet Industrial-Controller_Input; Supplier 1: Arrow Electronics; RoHS: Yes; Category: Chip SMD Resistors; Stock 1: 17580000; Pricing 1: 5000=0,00180 (USD); Case/Package: 0603; Number of Pins: 2; Case Code (Imperial): 0603; Case Code (Metric): 1608; Size Code: 0603; Min Operating Temperature: -55°C; Max Operating Temperature: 155°C; Resistance: 100R; Tolerance: 1%; Packaging: Tape and Reel; Resistor Type: Thick Film; Voltage Rating: 50V; Termination: SMD/SMT; Features: Moisture Resistant; Series: RC; Max Power Dissipation: 100mW; Number of Terminations: 2; Construction: Rectangular; Resistance Tolerance: 1%; Technology: THICK FILM; Length: 1.6mm; Width: 0.8mm; Height: 0.45mm; Depth: 0.8mm; REACH SVHC: Unknown; Lead Free: Lead Free; Military Standard: Not; RoHS Compliant: Yes; Supplier Part Number 1: RC0603FR-07100RL; Manufacturer Part Number 1: RC0603FR-07100RL